# Altium schematic sheet TopSheet.SchDoc
size A
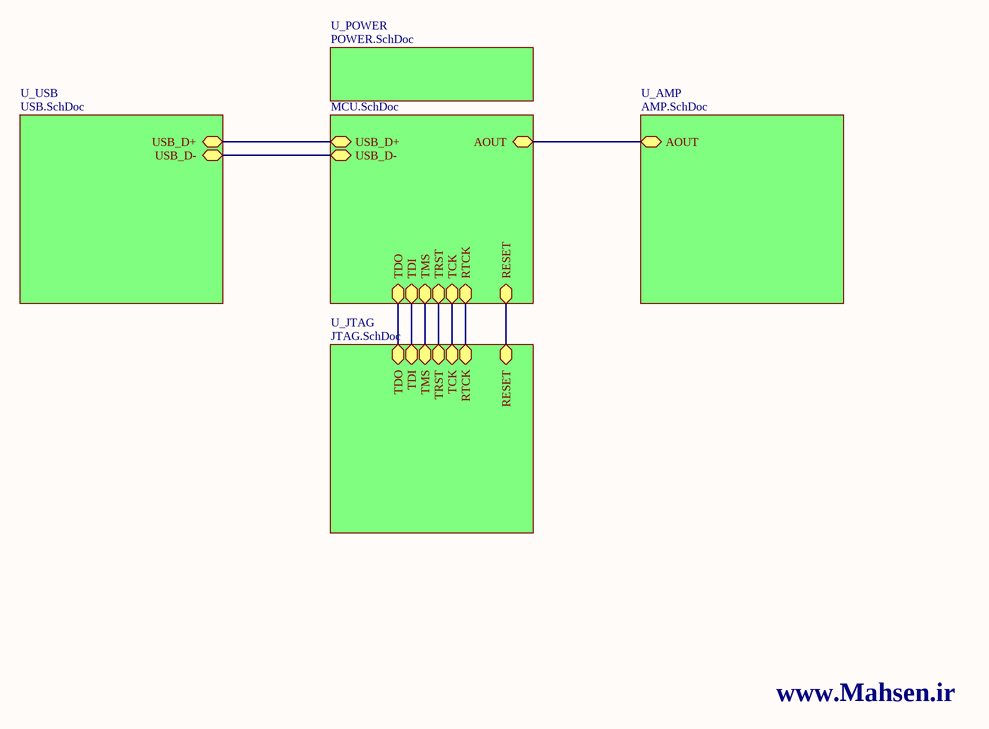
[diagram p0: TopSheet.SchDoc]

## Sub-sheets
U_AMP = AMP.SchDoc: AOUT (bidir)
U_JTAG = JTAG.SchDoc: TDO (bidir), TDI (bidir), TMS (bidir), TRST (bidir), TCK (bidir), RTCK (bidir), RESET (bidir)
U_MCU = MCU.SchDoc: AOUT (bidir), USB_D+ (bidir), USB_D- (bidir), TDO (bidir), TDI (bidir), TMS (bidir), TRST (bidir), TCK (bidir), RTCK (bidir), RESET (bidir)
U_POWER = POWER.SchDoc: no entries
U_USB = USB.SchDoc: USB_D+ (bidir), USB_D- (bidir)

## Nets
(unnamed): sheet U_AMP/AOUT, sheet U_MCU/AOUT
(unnamed): sheet U_JTAG/TDO, sheet U_MCU/TDO
(unnamed): sheet U_JTAG/TDI, sheet U_MCU/TDI
(unnamed): sheet U_JTAG/TMS, sheet U_MCU/TMS
(unnamed): sheet U_JTAG/TRST, sheet U_MCU/TRST
(unnamed): sheet U_JTAG/TCK, sheet U_MCU/TCK
(unnamed): sheet U_JTAG/RTCK, sheet U_MCU/RTCK
(unnamed): sheet U_JTAG/RESET, sheet U_MCU/RESET
(unnamed): sheet U_MCU/USB_D+, sheet U_USB/USB_D+
(unnamed): sheet U_MCU/USB_D-, sheet U_USB/USB_D-

## Notes on the sheet
- www.Mahsen.ir